# EAGLE schematic stm32 v1.1 (EAGLE 9.6.2)
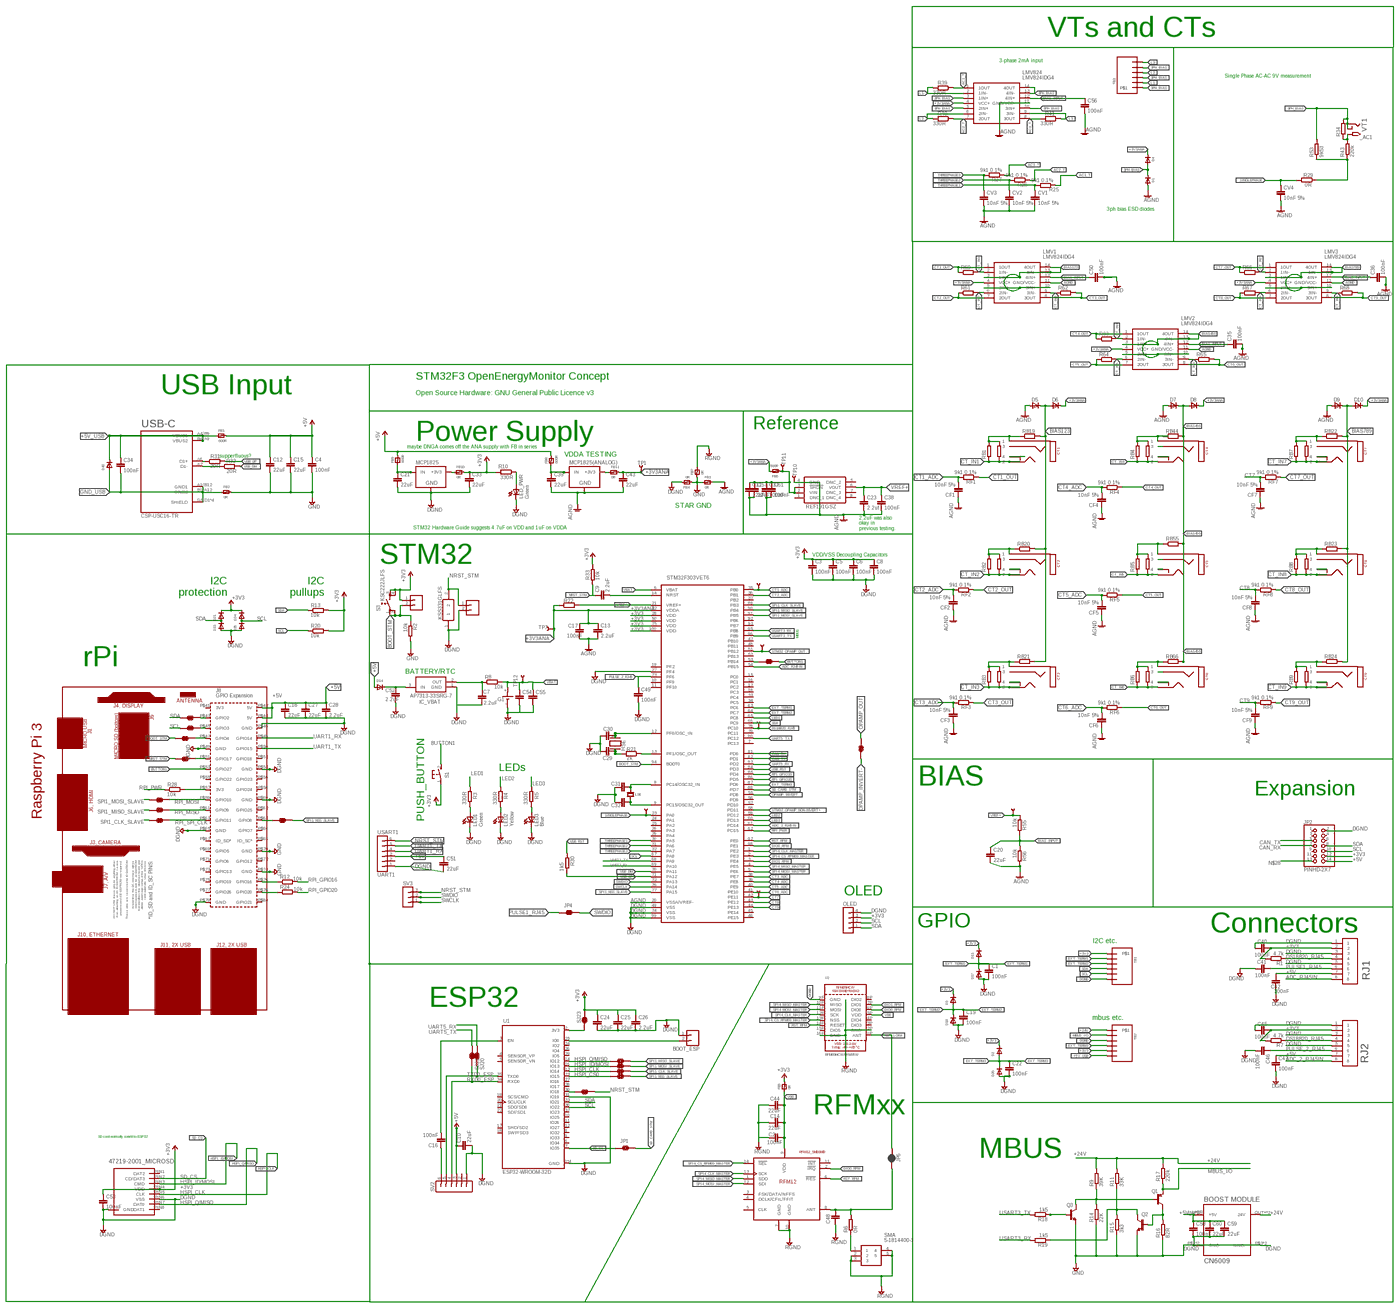
[diagram p0: schematic, sheet 1, overview]
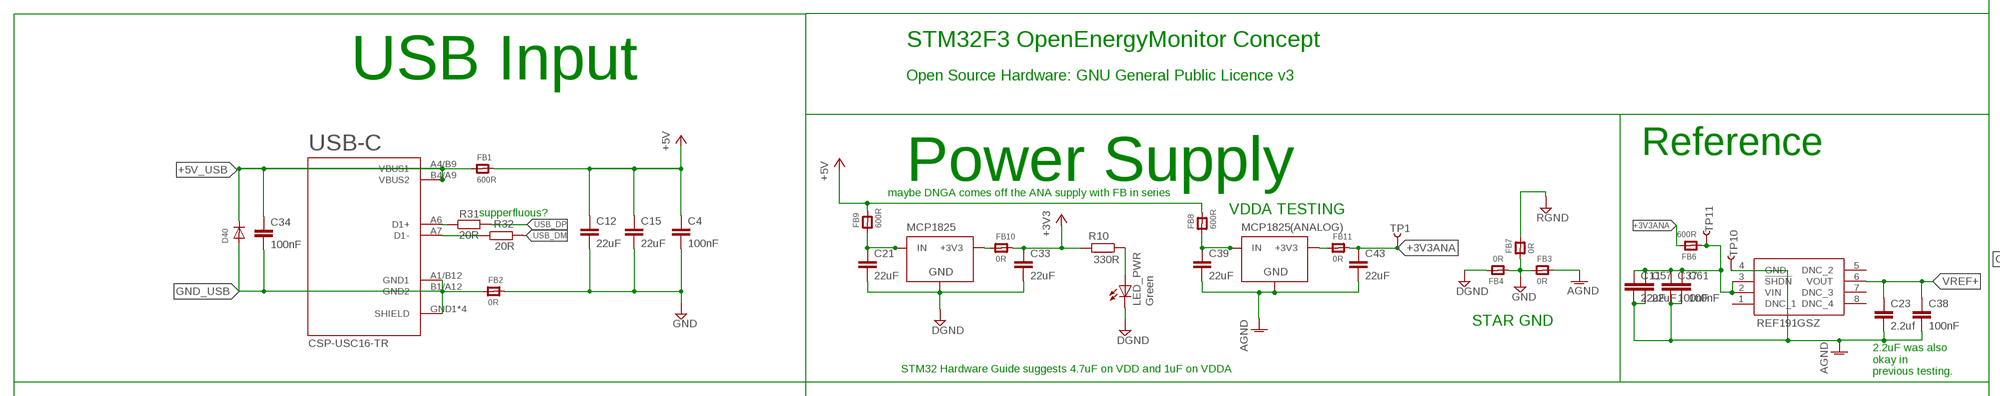
[diagram p1: schematic, sheet 1, part 1 of 4]
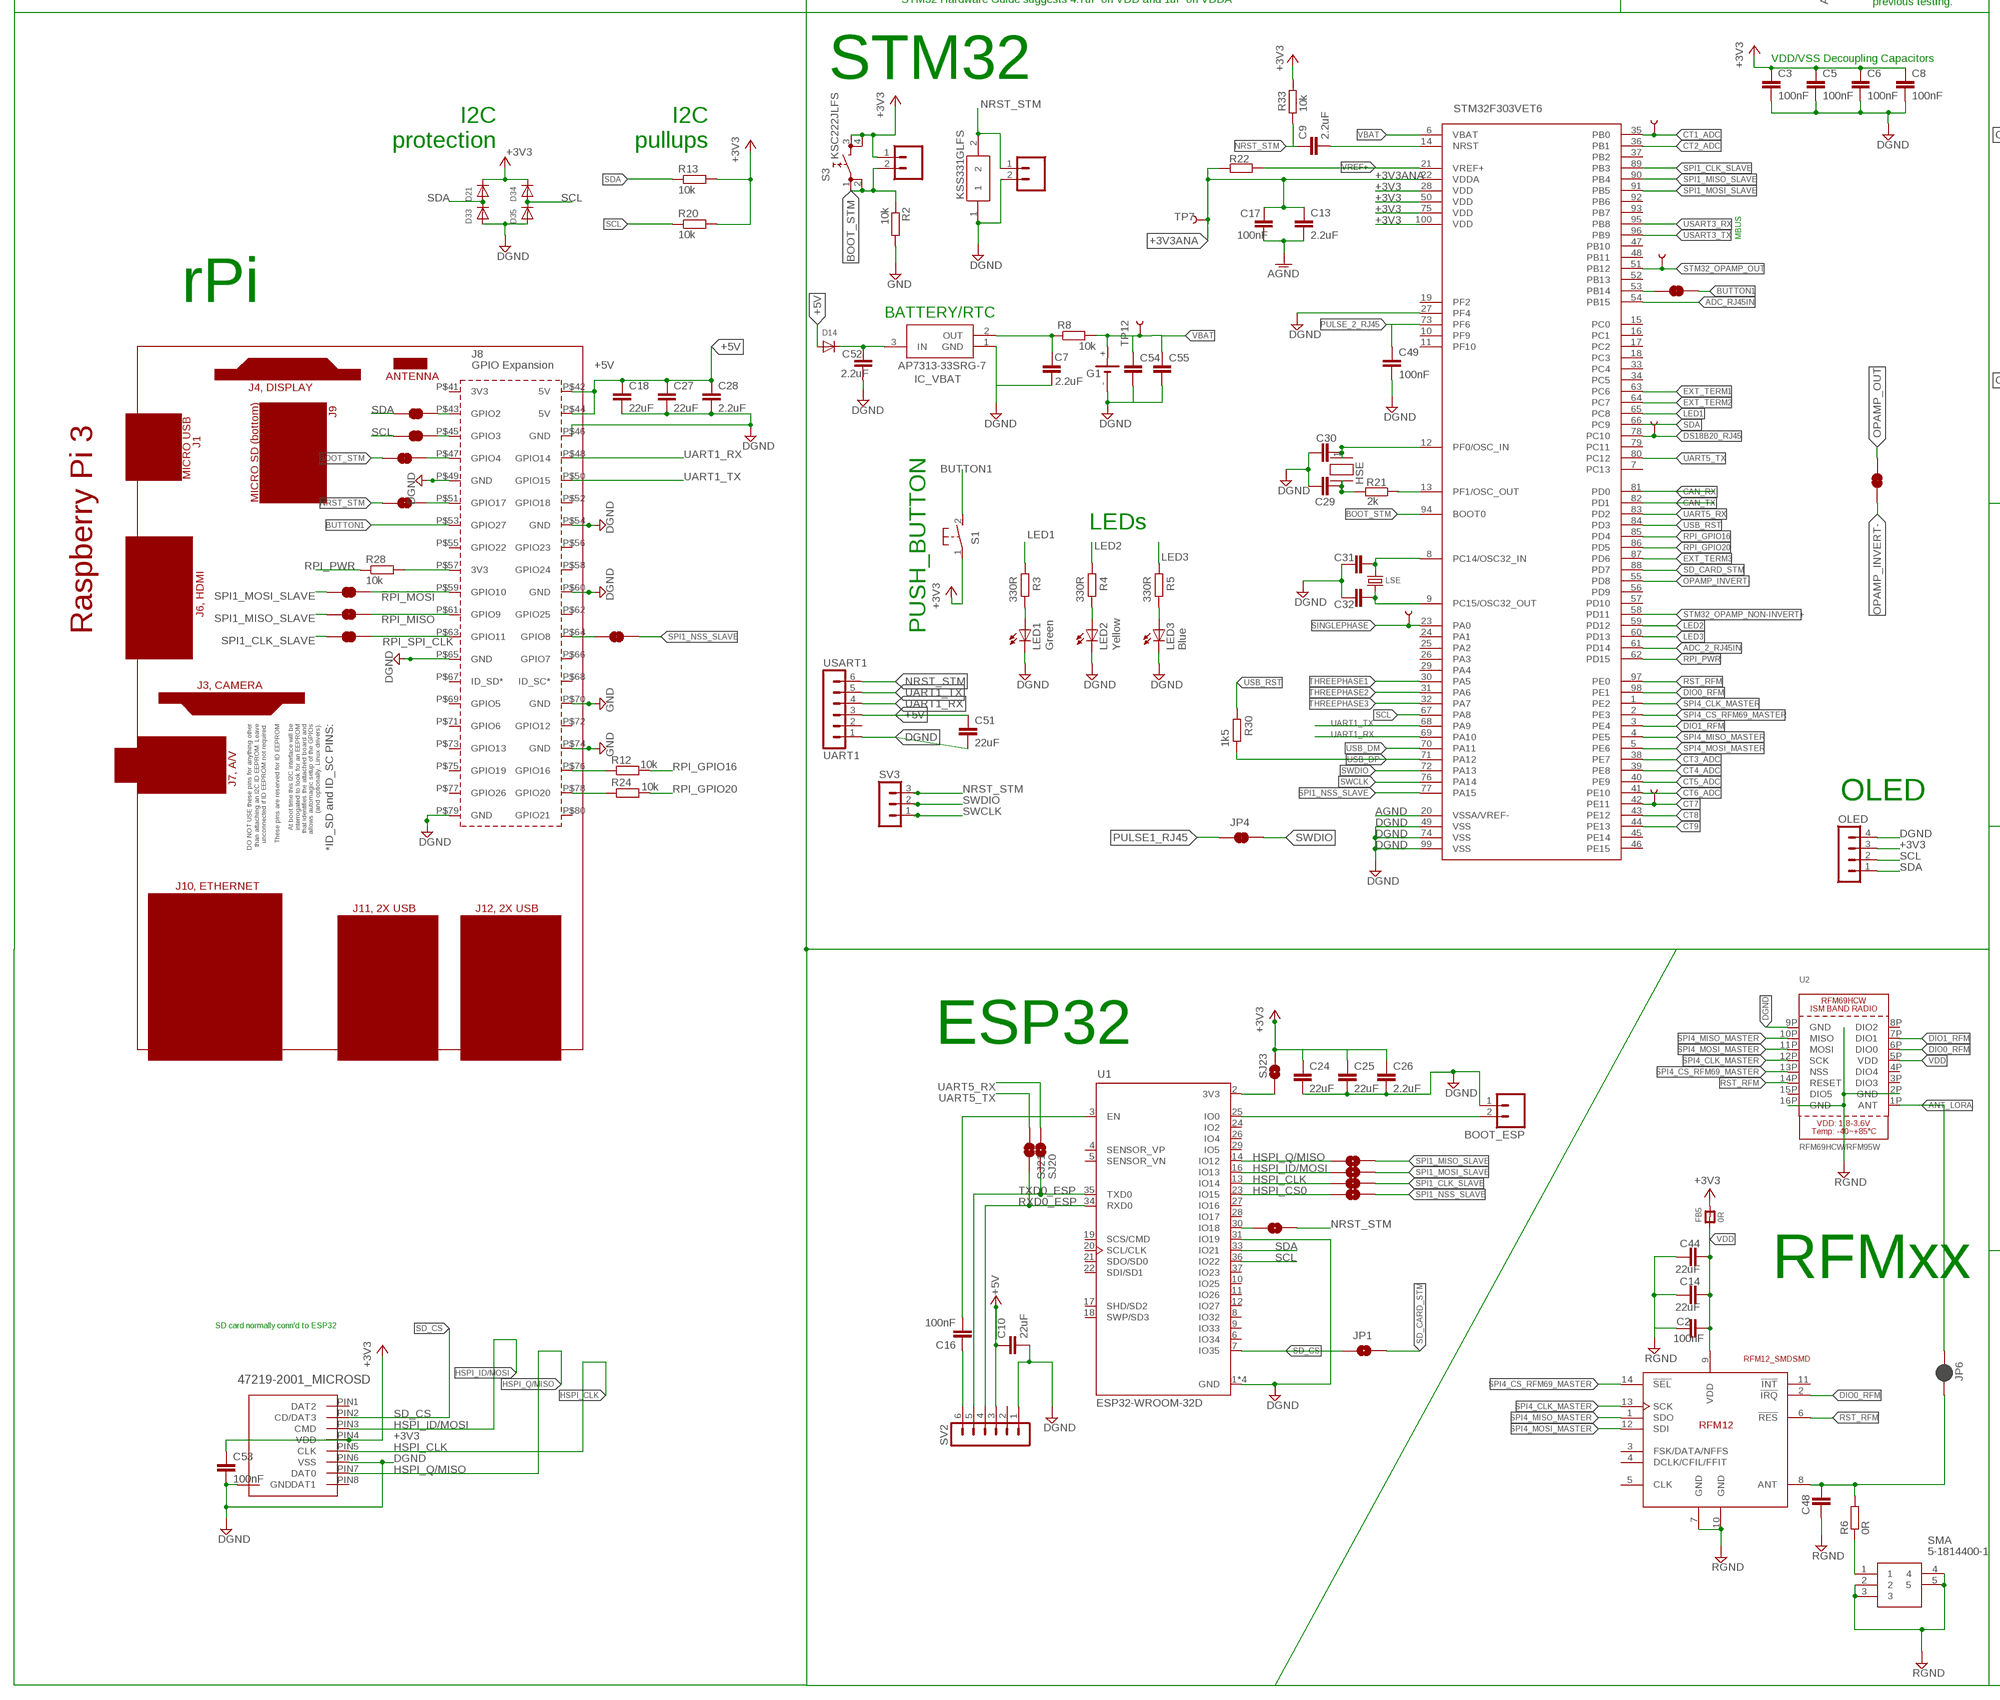
[diagram p2: schematic, sheet 1, part 2 of 4]
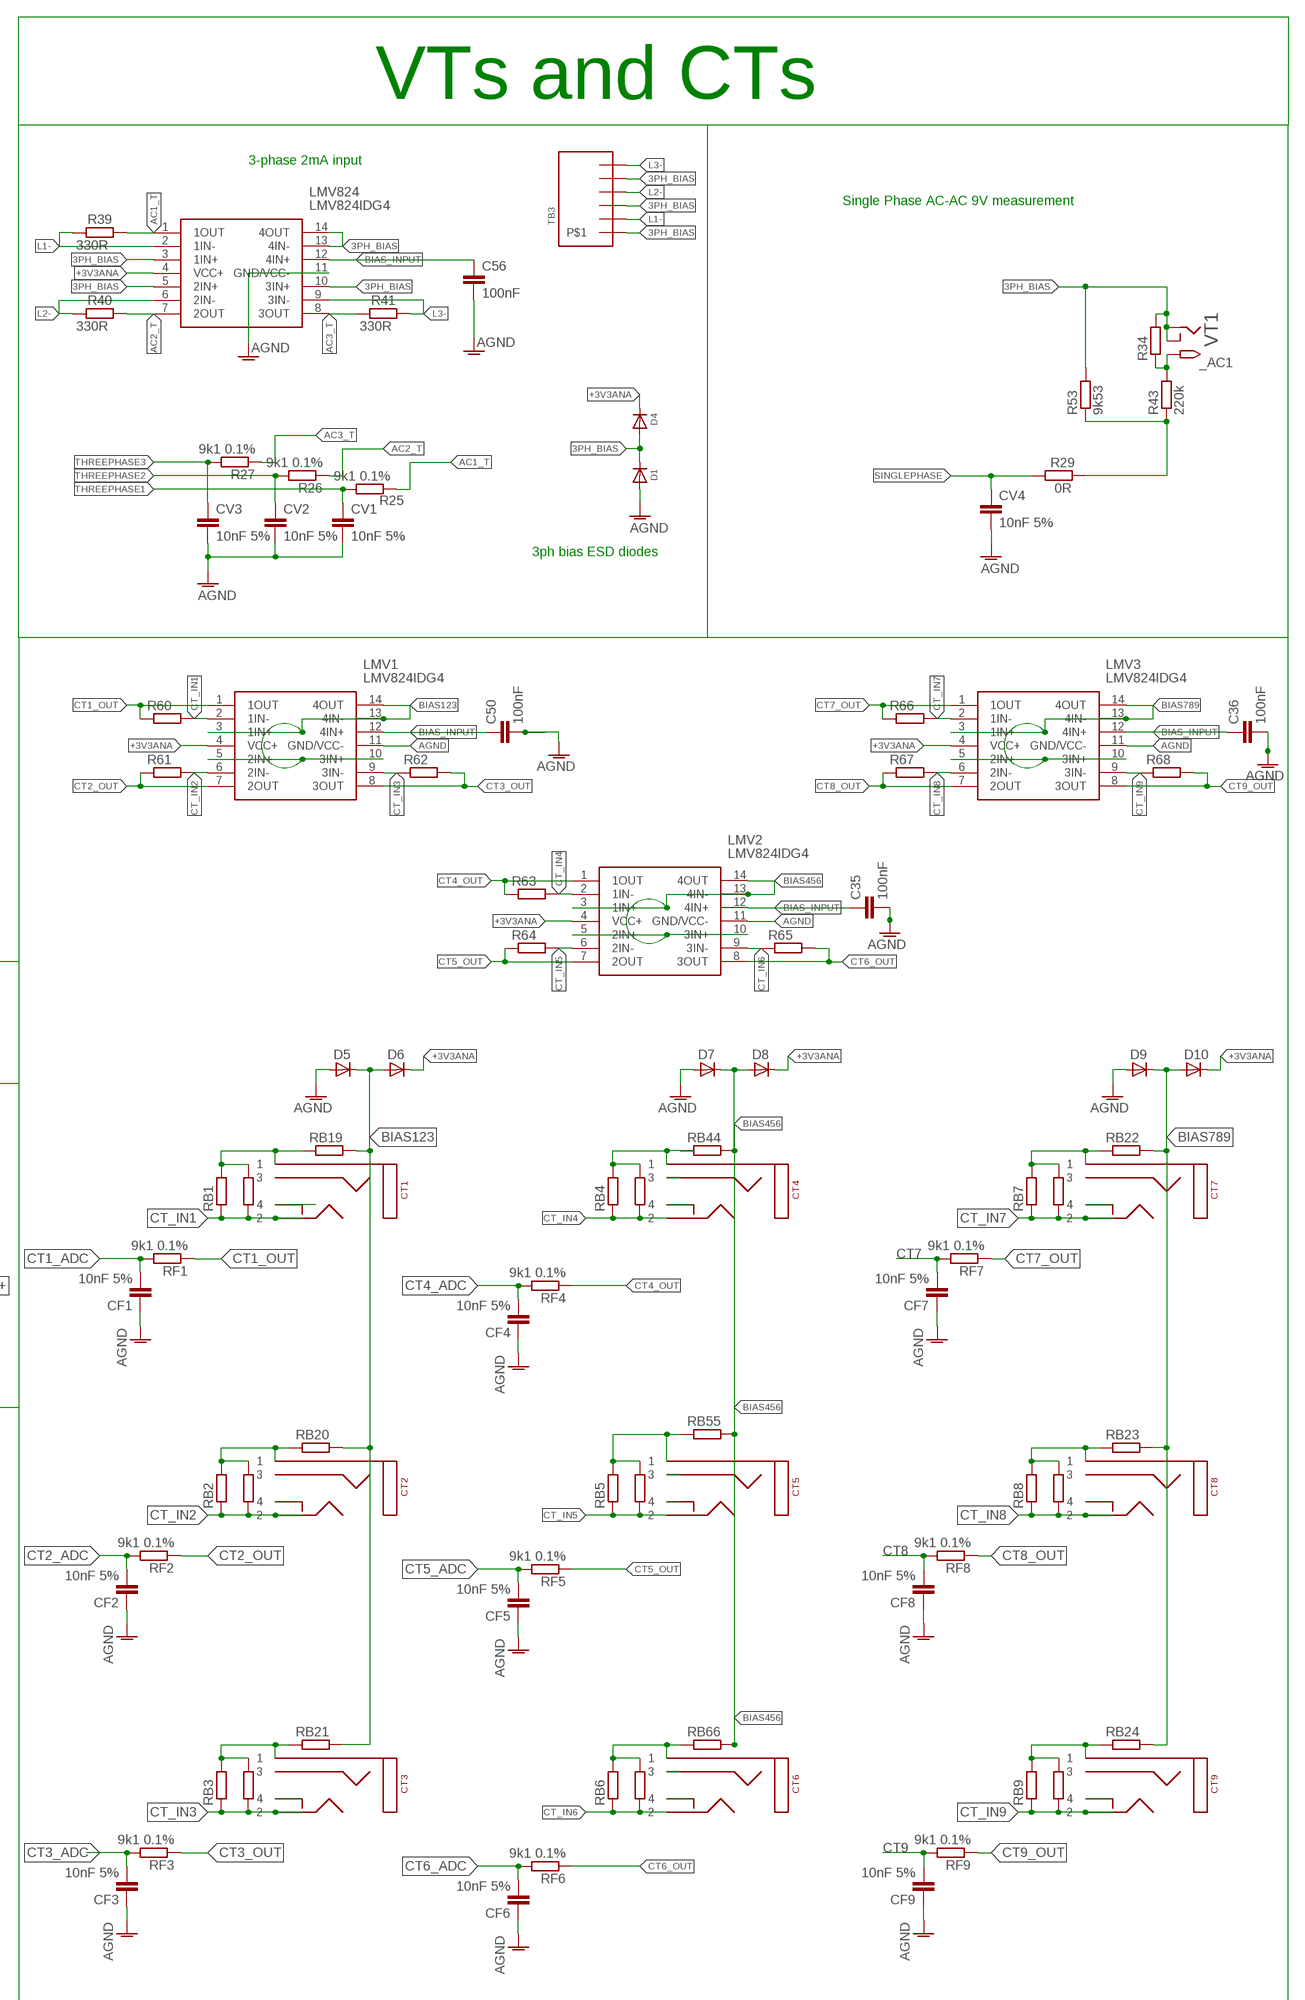
[diagram p3: schematic, sheet 1, part 3 of 4]
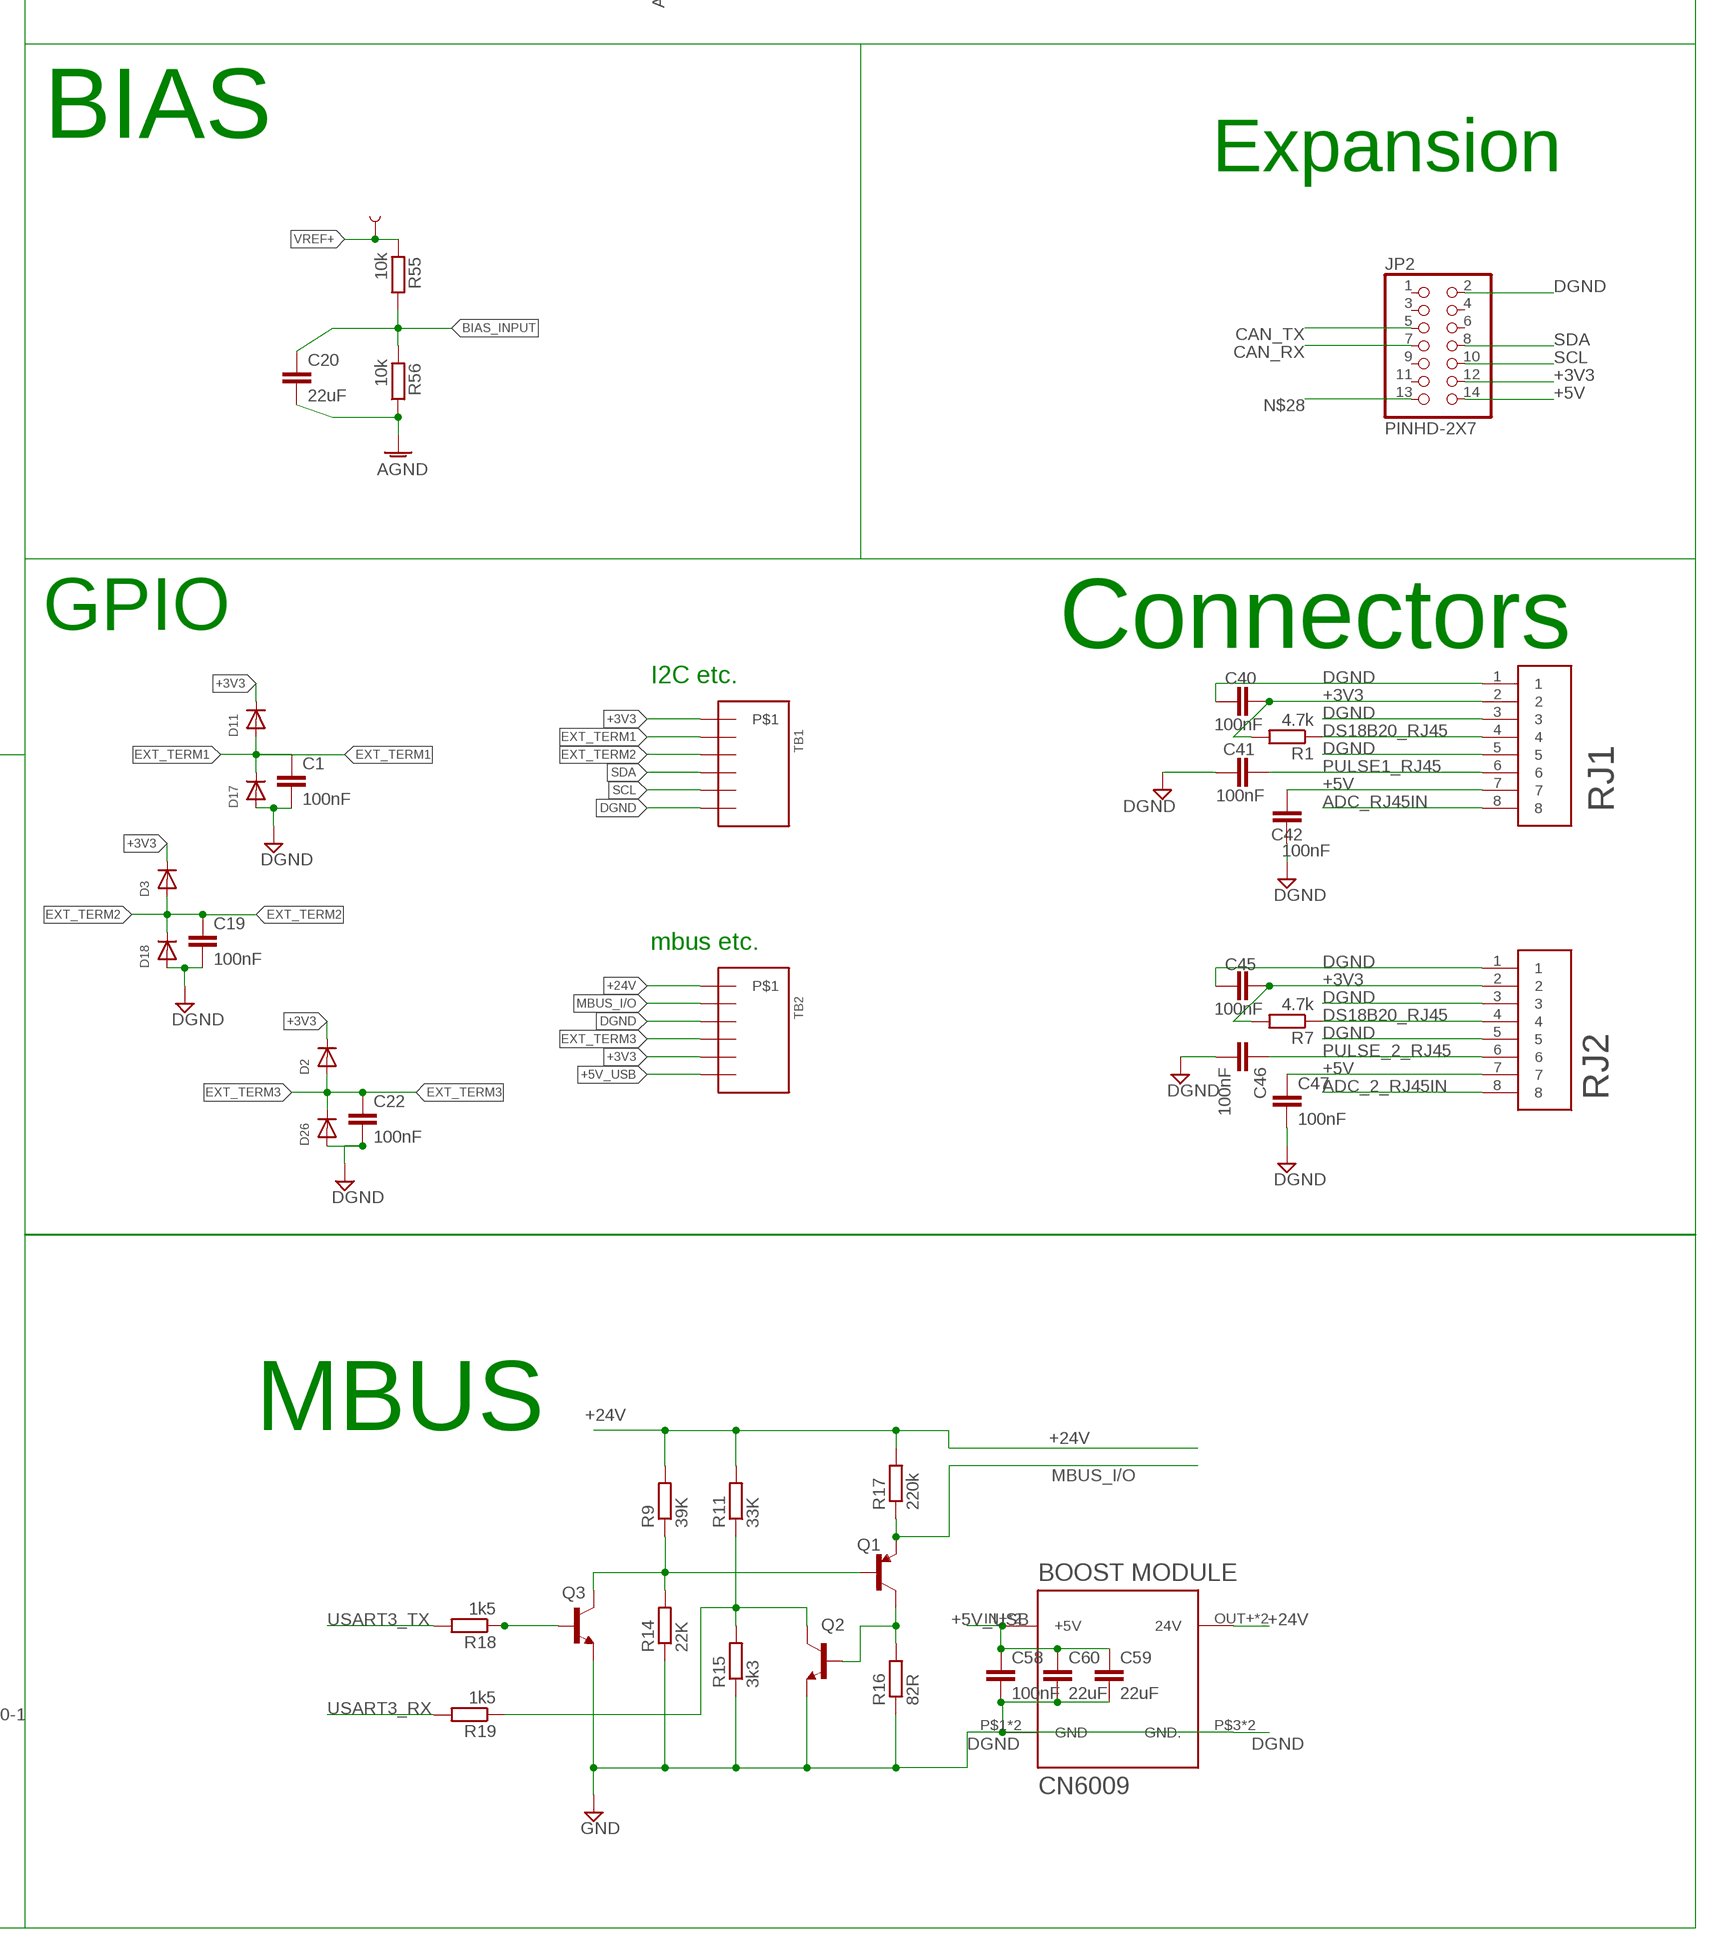
[diagram p4: schematic, sheet 1, part 4 of 4]

## Parts
BOOT  M02PTH  [1X02]
BOOT_ESP  M02PTH  [1X02]
C1  100nF  C-EUC0603  [C0603]
C2  100nF  C-EUC0603  [C0603]
C3  100nF  C-EUC0603  [C0603]
C4  100nF  C-EUC0603  [C0603]
C5  100nF  C-EUC0603  [C0603]
C6  100nF  C-EUC0603  [C0603]
C7  2.2uF  C-EUC0603  [C0603]
C8  100nF  C-EUC0603  [C0603]
C9  2.2uF  C-EUC0603  [C0603]
C10  22uF  C-EUC0805  [C0805]
C11  22uF  C-EUC0805  [C0805]
C12  22uF  C-EUC0805  [C0805]
C13  2.2uF  C-EUC0603  [C0603]
C14  22uF  C-EUC0805  [C0805]
C15  22uF  C-EUC0805  [C0805]
C16  100nF  C-EUC0603  [C0603]
C17  100nF  C-EUC0603  [C0603]
C18  22uF  C-EUC0805  [C0805]
C19  100nF  C-EUC0603  [C0603]
C20  22uF  C-EUC0805  [C0805]
C21  22uF  C-EUC0805  [C0805]
C22  100nF  C-EUC0603  [C0603]
C23  2.2uf  C-EUC0603  [C0603]
C24  22uF  C-EUC0805  [C0805]
C25  22uF  C-EUC0805  [C0805]
C26  2.2uF  C-EUC0603  [C0603]
C27  22uF  C-EUC0805  [C0805]
C28  2.2uF  C-EUC0603  [C0603]
C29  15pF  C-EUC0603  [C0603]
C30  15pF  C-EUC0603  [C0603]
C31  10pF  C-EUC0603  [C0603]
C32  10pF  C-EUC0603  [C0603]
C33  22uF  C-EUC0805  [C0805]
C34  100nF  C-EUC0603  [C0603]
C35  100nF  C-EUC0603  [C0603]
C36  100nF  C-EUC0603  [C0603]
C37  100nF  C-EUC0603  [C0603]
C38  100nF  C-EUC0603  [C0603]
C39  22uF  C-EUC0805  [C0805]
C40  100nF  C-EUC0603  [C0603]
C41  100nF  C-EUC0603  [C0603]
C42  100nF  C-EUC0603  [C0603]
C43  22uF  C-EUC0805  [C0805]
C44  22uF  C-EUC0805  [C0805]
C45  100nF  C-EUC0603  [C0603]
C46  100nF  C-EUC0603  [C0603]
C47  100nF  C-EUC0603  [C0603]
C48  C-EUC0603  [C0603]
C49  100nF  C-EUC0603  [C0603]
C50  100nF  C-EUC0603  [C0603]
C51  22uF  C-EUC0805  [C0805]
C52  2.2uF  C-EUC0603  [C0603]
C53  100nF  C-EUC0603  [C0603]
C54  22uF  C-EUC0805  [C0805]
C55  22uF  C-EUC0805  [C0805]
C56  100nF  C-EUC0603  [C0603]
C57  22uF  C-EUC0805  [C0805]
C58  100nF  C-EUC0603  [C0603]
C59  22uF  C-EUC0805  [C0805]
C60  22uF  C-EUC0805  [C0805]
C61  100nF  C-EUC0603  [C0603]
CF1  10nF 5%  C-EUC0805  [C0805]
CF2  10nF 5%  C-EUC0805  [C0805]
CF3  10nF 5%  C-EUC0805  [C0805]
CF4  10nF 5%  C-EUC0805  [C0805]
CF5  10nF 5%  C-EUC0805  [C0805]
CF6  10nF 5%  C-EUC0805  [C0805]
CF7  10nF 5%  C-EUC0805  [C0805]
CF8  10nF 5%  C-EUC0805  [C0805]
CF9  10nF 5%  C-EUC0805  [C0805]
CT1  SJ-3523-SMT  SJ-3523-SMTSJ-352X-SMT_SERIES-1313220  [SJ-352X-SMT]
CT2  SJ-3523-SMT  SJ-3523-SMTSJ-352X-SMT_SERIES-1313220  [SJ-352X-SMT]
CT3  SJ-3523-SMT  SJ-3523-SMTSJ-352X-SMT_SERIES-1313220  [SJ-352X-SMT]
CT4  SJ-3523-SMT  SJ-3523-SMTSJ-352X-SMT_SERIES-1313220  [SJ-352X-SMT]
CT5  SJ-3523-SMT  SJ-3523-SMTSJ-352X-SMT_SERIES-1313220  [SJ-352X-SMT]
CT6  SJ-3523-SMT  SJ-3523-SMTSJ-352X-SMT_SERIES-1313220  [SJ-352X-SMT]
CT7  SJ-3523-SMT  SJ-3523-SMTSJ-352X-SMT_SERIES-1313220  [SJ-352X-SMT]
CT8  SJ-3523-SMT  SJ-3523-SMTSJ-352X-SMT_SERIES-1313220  [SJ-352X-SMT]
CT9  SJ-3523-SMT  SJ-3523-SMTSJ-352X-SMT_SERIES-1313220  [SJ-352X-SMT]
CV1  10nF 5%  C-EUC0805  [C0805]
CV2  10nF 5%  C-EUC0805  [C0805]
CV3  10nF 5%  C-EUC0805  [C0805]
CV4  10nF 5%  C-EUC0805  [C0805]
D1  DIODESOD-523  [SOD-523]
D2  ESD5Z3.3T1G  DIODESOD-523  [SOD-523]
D3  ESD5Z3.3T1G  DIODESOD-523  [SOD-523]
D4  DIODESOD-523  [SOD-523]
D5  DIODESOD-523  [SOD-523]
D6  DIODESOD-523  [SOD-523]
D7  DIODESOD-523  [SOD-523]
D8  DIODESOD-523  [SOD-523]
D9  DIODESOD-523  [SOD-523]
D10  DIODESOD-523  [SOD-523]
D11  ESD5Z3.3T1G  DIODESOD-523  [SOD-523]
D14  ESD5Z3.3T1G  DIODESOD-523  [SOD-523]
D17  ESD5Z3.3T1G  DIODESOD-523  [SOD-523]
D18  ESD5Z3.3T1G  DIODESOD-523  [SOD-523]
D21  ESD5Z3.3T1G  DIODESOD-523  [SOD-523]
D26  ESD5Z3.3T1G  DIODESOD-523  [SOD-523]
D33  ESD5Z3.3T1G  DIODESOD-523  [SOD-523]
D34  ESD5Z3.3T1G  DIODESOD-523  [SOD-523]
D35  ESD5Z3.3T1G  DIODESOD-523  [SOD-523]
D40  ESD5Z5.0T1G  DIODESOD-523  [SOD-523]
FB1  600R  FERRITE  [0603]
FB2  0R  FERRITE  [0603]
FB3  0R  FERRITE_0603  [_0603]
FB4  0R  FERRITE_0603  [_0603]
FB5  0R  FERRITE_0603  [_0603]
FB6  600R  FERRITE_0603  [_0603]
FB7  0R  FERRITE_0603  [_0603]
FB8  600R  FERRITE_0603  [_0603]
FB9  600R  FERRITE_0603  [_0603]
FB10  0R  FERRITE_0603  [_0603]
FB11  0R  FERRITE_0603  [_0603]
G1  CH291-1220LF  [CH291-1220LF]
HSE  6MM_3.5MM_CRYSTAL  [ABMM2]
IC_VBAT  AP7313-33SRG-7  [SOT96P240X135-3N]
J1  JUMPER-SMT_2_NC_TRACE_NO-SILK  [SMT-JUMPER_2_NC_TRACE_NO-SILK]
JP1  JUMPER-SMT_2_NO_NO-SILK  [SMT-JUMPER_2_NO_NO-SILK]
JP2  PINHD-2X7  [2X07]
JP4  JUMPER-SMT_2_NC_TRACE_NO-SILK  [SMT-JUMPER_2_NC_TRACE_NO-SILK]
JP6  JUMPER-SMT_2_NC_PASTE_SILK  [SMT-JUMPER_2_NC_PASTE_SILK]
KSS331GLFS  KSS221GLFS  [KSS]
LED1  Green  LEDCHIP-LED0805  [CHIP-LED0805]
LED2  Yellow  LEDCHIP-LED0805  [CHIP-LED0805]
LED3  Blue  LEDCHIP-LED0805  [CHIP-LED0805]
LED_PWR  Green  LEDCHIP-LED0805  [CHIP-LED0805]
LMV1  LMV824IDG4  [SOIC127P600X175-14N]
LMV2  LMV824IDG4  [SOIC127P600X175-14N]
LMV3  LMV824IDG4  [SOIC127P600X175-14N]
LMV824  LMV824IDG4  [SOIC127P600X175-14N]
LSE  32.768kHz  CRYSTAL8X3.8SMT  [CRYSTAL_8X3.8]
MCP1825  MCP1825SOT-223-3  [SOT-223]
MCP1825(ANALOG)  MCP1825SOT-223-3  [SOT-223]
MICROSD  47219-2001_MICROSD  [47219-2001_MICROSD]
OLED  MA04-1-OLEDOLED  [MA04-1-OLED]
PCB2  RPI3YA  [RPI3MIRROR2]
Q1  PNP  TRANSISTOR_PNPSOT23-REFLOW  [SOT23-R]
Q2  NPN  TRANSISTOR_NPN  [SOT23-R]
Q3  NPN  TRANSISTOR_NPN  [SOT23-R]
R1  4.7k  R-EU_R0603  [R0603]
R2  10k  R-EU_R0603  [R0603]
R3  330R  R-EU_R0603  [R0603]
R4  330R  R-EU_R0603  [R0603]
R5  330R  R-EU_R0603  [R0603]
R6  0R  R-EU_R0603  [R0603]
R7  4.7k  R-EU_R0603  [R0603]
R8  10k  R-EU_R0603  [R0603]
R9  39K  R-EU_R0603  [R0603]
R10  330R  R-EU_R0603  [R0603]
R11  33K  R-EU_R0603  [R0603]
R12  10k  R-EU_R0603  [R0603]
R13  10k  R-EU_R0603  [R0603]
R14  22K  R-EU_R0603  [R0603]
R15  3k3  R-EU_R0603  [R0603]
R16  82R  R-EU_R0603  [R0603]
R17  220k  R-EU_R0603  [R0603]
R18  1k5  R-EU_R0603  [R0603]
R19  1k5  R-EU_R0603  [R0603]
R20  10k  R-EU_R0603  [R0603]
R21  2k  R-EU_R0603  [R0603]
R22  R-EU_R0603  [R0603]
R24  10k  R-EU_R0603  [R0603]
R25  9k1 0.1%  R-EU_R0603  [R0603]
R26  9k1 0.1%  R-EU_R0603  [R0603]
R27  9k1 0.1%  R-EU_R0603  [R0603]
R28  10k  R-EU_R0603  [R0603]
R29  0R  R-EU_R0603  [R0603]
R30  1k5  R-EU_R0603  [R0603]
R31  20R  R-EU_R0603  [R0603]
R32  20R  R-EU_R0603  [R0603]
R33  10k  R-EU_R0603  [R0603]
R34  R-EU_R1210  [R1210]
R39  330R  R-EU_R0603  [R0603]
R40  330R  R-EU_R0603  [R0603]
R41  330R  R-EU_R0603  [R0603]
R43  220k  R-EU_R0603  [R0603]
R53  9k53  R-EU_R0603  [R0603]
R55  10k  R-EU_R0603  [R0603]
R56  10k  R-EU_R0603  [R0603]
R60  510R 0.1%  R-EU_R0603  [R0603]
R61  510R 0.1%  R-EU_R0603  [R0603]
R62  510R 0.1%  R-EU_R0603  [R0603]
R63  510R 0.1%  R-EU_R0603  [R0603]
R64  510R 0.1%  R-EU_R0603  [R0603]
R65  510R 0.1%  R-EU_R0603  [R0603]
R66  510R 0.1%  R-EU_R0603  [R0603]
R67  510R 0.1%  R-EU_R0603  [R0603]
R68  510R 0.1%  R-EU_R0603  [R0603]
RB1  6R81  R-EU_R0805  [R0805]
RB1_  R-EU_0207/10  [0207/10]
RB2  6R81  R-EU_R0805  [R0805]
RB2_  R-EU_0207/10  [0207/10]
RB3  6R81  R-EU_R0805  [R0805]
RB3_  R-EU_0207/10  [0207/10]
RB4  6R81  R-EU_R0805  [R0805]
RB4_  R-EU_0207/10  [0207/10]
RB5  6R81  R-EU_R0805  [R0805]
RB5_  R-EU_0207/10  [0207/10]
RB6  6R81  R-EU_R0805  [R0805]
RB6_  R-EU_0207/10  [0207/10]
RB7  6R81  R-EU_R0805  [R0805]
RB7_  R-EU_0207/10  [0207/10]
RB8  6R81  R-EU_R0805  [R0805]
RB8_  R-EU_0207/10  [0207/10]
RB9  6R81  R-EU_R0805  [R0805]
RB9_  R-EU_0207/10  [0207/10]
RB19  680R | 681R 0.1%  R-EU_R0603  [R0603]
RB20  680R | 681R 0.1%  R-EU_R0603  [R0603]
RB21  680R | 681R 0.1%  R-EU_R0603  [R0603]
RB22  680R | 681R 0.1%  R-EU_R0603  [R0603]
RB23  680R | 681R 0.1%  R-EU_R0603  [R0603]
RB24  680R | 681R 0.1%  R-EU_R0603  [R0603]
RB44  680R | 681R 0.1%  R-EU_R0603  [R0603]
RB55  680R | 681R 0.1%  R-EU_R0603  [R0603]
RB66  680R | 681R 0.1%  R-EU_R0603  [R0603]
REF19X  REF191ESZ  LT1461AIS8-3.3#PBF  [SOIC127P599X175-8N]
RF1  9k1 0.1%  R-EU_R0603  [R0603]
RF2  9k1 0.1%  R-EU_R0603  [R0603]
RF3  9k1 0.1%  R-EU_R0603  [R0603]
RF4  9k1 0.1%  R-EU_R0603  [R0603]
RF5  9k1 0.1%  R-EU_R0603  [R0603]
RF6  9k1 0.1%  R-EU_R0603  [R0603]
RF7  9k1 0.1%  R-EU_R0603  [R0603]
RF8  9k1 0.1%  R-EU_R0603  [R0603]
RF9  9k1 0.1%  R-EU_R0603  [R0603]
RFM69HCW  RFM12_SMDSMD  [RFM12]
RJ1  95501-6889  [955016889]
RJ2  95501-6889  [955016889]
RST_STM  M02PTH  [1X02]
S1  31-XX  [B3F-31XX]
S3  KSC222JLFS  [KSC222JLFS]
SJ1  JUMPER-SMT_2_NC_TRACE_NO-SILK  [SMT-JUMPER_2_NC_TRACE_NO-SILK]
SJ3  JUMPER-SMT_2_NC_TRACE_NO-SILK  [SMT-JUMPER_2_NC_TRACE_NO-SILK]
SJ4  JUMPER-SMT_2_NO_SILK  [SMT-JUMPER_2_NO_SILK]
SJ5  JUMPER-SMT_2_NC_TRACE_NO-SILK  [SMT-JUMPER_2_NC_TRACE_NO-SILK]
SJ6  JUMPER-SMT_2_NC_TRACE_NO-SILK  [SMT-JUMPER_2_NC_TRACE_NO-SILK]
SJ7  JUMPER-SMT_2_NC_TRACE_NO-SILK  [SMT-JUMPER_2_NC_TRACE_NO-SILK]
SJ9  JUMPER-SMT_2_NO_SILK  [SMT-JUMPER_2_NO_SILK]
SJ10  JUMPER-SMT_2_NO_SILK  [SMT-JUMPER_2_NO_SILK]
SJ13  JUMPER-SMT_2_NO_SILK  [SMT-JUMPER_2_NO_SILK]
SJ14  JUMPER-SMT_2_NC_TRACE_NO-SILK  [SMT-JUMPER_2_NC_TRACE_NO-SILK]
SJ20  SOLDERJUMPERNO  [SJ_2S-NO]
SJ21  SOLDERJUMPERNO  [SJ_2S-NO]
SJ23  SOLDERJUMPERNO  [SJ_2S-NO]
SJ25  SOLDERJUMPERNO  [SJ_2S-NO]
SJ26  JUMPER-SMT_2_NC_TRACE_NO-SILK  [SMT-JUMPER_2_NC_TRACE_NO-SILK]
SJ27  JUMPER-SMT_2_NC_TRACE_NO-SILK  [SMT-JUMPER_2_NC_TRACE_NO-SILK]
SJ32  JUMPER-SMT_2_NC_TRACE_NO-SILK  [SMT-JUMPER_2_NC_TRACE_NO-SILK]
SMA  5-1814400-1  [518144001]
STM32F303VET6  STM32F303VE  STM32F303XB  [TQFP100]
SV2  MA06-1  [MA06-1]
SV3  MA03-1  [MA03-1]
TB1  3.5MM_TB_X6  [3.5MM_X6]
TB2  3.5MM_TB_X6  [3.5MM_X6]
TB3  3.5MM_TB_X6  [3.5MM_X6]
TP1  TEST-POINTPOGO_PTH  [1X01_NO_SILK]
TP2  TEST-POINTPOGO_PTH  [1X01_NO_SILK]
TP7  TEST-POINTPOGO_PTH  [1X01_NO_SILK]
TP8  TEST-POINTPOGO_PTH  [1X01_NO_SILK]
TP9  TEST-POINTPOGO_PTH  [1X01_NO_SILK]
TP10  TEST-POINTPOGO_PTH  [1X01_NO_SILK]
TP11  TEST-POINTPOGO_PTH  [1X01_NO_SILK]
TP12  TEST-POINT3  [PAD.03X.03]
TP18  TEST-POINTPOGO_PTH  [1X01_NO_SILK]
TP19  TEST-POINTPOGO_PTH  [1X01_NO_SILK]
TP20  TEST-POINTPOGO_PTH  [1X01_NO_SILK]
U1  ESP32-WROOM-32D  [MODULE_ESP32-WROOM-32D]
U2  RFM69HCW/RFM95W  RFM69HCW_SMT  [RFMHCW_SMT]
U$2  BOOST_MODULEBOTHCONN  [BOOST]
USART1  UART1  MA06-1  [MA06-1]
USB-C  CSP-USC16-TR  [USB-C]
VT1  ADC-028-2-T  2.1MMJACKSMT  [DCJACK_2MM_SMT]

## Nets
3PH_BIAS: D1.K(C) D4.A LMV824.3(1IN+) LMV824.5(2IN+) LMV824.10(3IN+) LMV824.13(4IN-) LMV824.14(4OUT) R34.2 R53.2 TB3.P$1 TB3.P$3 TB3.P$5 VT1.GND(RING) VT1.GNDBREAK(RING_SW)
+3V3 [power]: BOOT.1 C3.1 C5.1 C6.1 C8.1 C24.1 C25.1 C26.1 C33.1 C40.1 C45.1 C53.1 D2.K(C) D3.K(C) D11.K(C) D21.K(C) D34.K(C) FB5.2 FB10.2 JP2.12 MICROSD.PIN4(VDD) OLED.3 R1.2 R7.2 R10.2 R13.2 R20.2 R33.1 RJ1.2 RJ2.2 S1.1(P) S3.3 S3.4 SJ23.2 STM32F303VET6.28(VDD) STM32F303VET6.50(VDD) STM32F303VET6.75(VDD) STM32F303VET6.100(VDD) TB1.P$1 TB2.P$5
+3V3ANA [power]: C13.1 C17.1 C43.1 D4.K(C) D6.K(C) D8.K(C) D10.K(C) FB6.2 FB11.2 LMV1.4(VCC+) LMV2.4(VCC+) LMV3.4(VCC+) LMV824.4(VCC+) R22.1 STM32F303VET6.22(VDDA) TP1.1 TP7.1
+5V [power]: C4.1 C10.1 C12.1 C15.1 C18.1 C27.1 C28.1 C42.1 C47.1 C51.1 D14.A FB1.2 FB8.2 FB9.2 JP2.14 PCB2.P$42(5V) PCB2.P$44(5V) RJ1.7 RJ2.7 SV2.3 USART1.3
+5V_A [power]: C39.1 FB8.1 MCP1825(ANALOG).1(IN)
+5V_BATT [power]: C52.1 D14.K(C) IC_VBAT.3(IN)
+5V_D [power]: C21.1 FB9.1 MCP1825.1(IN)
+5V_USB [power]: C34.1 C58.1 C59.1 C60.1 D40.K(C) FB1.1 TB2.P$6 U$2.IN+1(+5V) U$2.IN+(+5V) USB-C.A4/B9(VBUS1) USB-C.B4/A9(VBUS2)
+24V: R9.2 R11.2 R17.2 TB2.P$1 U$2.OUT+1(24V) U$2.OUT+(24V)
_AC1: R34.1 R43.2 VT1.PWR2(TIP)
AC1: R29.1 R43.1 R53.1
AC1_T: LMV824.1(1OUT) R25.1 R39.1
AC2_T: LMV824.7(2OUT) R26.1 R40.1
AC3_T: LMV824.8(3OUT) R27.1 R41.2
ADC_2_RJ45IN: RJ2.8 STM32F303VET6.61(PD14)
ADC_RJ45IN: RJ1.8 STM32F303VET6.54(PB15)
AGND [gnd]: C11.2 C13.2 C17.2 C20.2 C23.2 C35.2 C36.2 C37.2 C38.2 C39.2 C43.2 C50.2 C56.2 C57.2 C61.2 CF1.1 CF2.1 CF3.1 CF4.1 CF5.1 CF6.1 CF7.1 CF8.1 CF9.1 CV1.2 CV2.2 CV3.2 CV4.2 D1.A D5.A D7.A D9.A FB3.2 LMV1.11(GND/VCC-) LMV2.11(GND/VCC-) LMV3.11(GND/VCC-) LMV824.11(GND/VCC-) MCP1825(ANALOG).2(GND) MCP1825(ANALOG).4(GND) R56.1 REF19X.4(GND) STM32F303VET6.20(VSSA/VREF-) TP10.1
ANT [ant]: C48.1 JP6.2 R6.2 RFM69HCW.8(ANT)
ANT_LORA [ant]: JP6.1 U2.1P(ANT)
BIAS123: D5.K(C) D6.A LMV1.3(1IN+) LMV1.5(2IN+) LMV1.10(3IN+) LMV1.13(4IN-) LMV1.14(4OUT) RB19.2 RB20.2 RB21.2
BIAS456: D7.K(C) D8.A LMV2.3(1IN+) LMV2.5(2IN+) LMV2.10(3IN+) LMV2.13(4IN-) LMV2.14(4OUT) RB44.2 RB55.2 RB66.2
BIAS789: D9.K(C) D10.A LMV3.3(1IN+) LMV3.5(2IN+) LMV3.10(3IN+) LMV3.13(4IN-) LMV3.14(4OUT) RB22.2 RB23.2 RB24.2
BIAS_INPUT: C20.1 C35.1 C36.1 C50.1 C56.1 LMV1.12(4IN+) LMV2.12(4IN+) LMV3.12(4IN+) LMV824.12(4IN+) R55.1 R56.2
BOOT0_RPI: J1.2 PCB2.P$47(GPIO4)
BOOT_STM: BOOT.2 J1.1 R2.1 S3.1 S3.2 STM32F303VET6.94(BOOT0)
BUTTON1: PCB2.P$53(GPIO27) S1.2(S) SJ3.1
BUTTON1_STM: SJ3.2 STM32F303VET6.53(PB14)
CAN_RX: JP2.7 STM32F303VET6.81(PD0)
CAN_TX: JP2.5 STM32F303VET6.82(PD1)
CT1_ADC [cts_vts]: CF1.2 RF1.2 STM32F303VET6.35(PB0) TP18.1
CT1_OUT: LMV1.1(1OUT) R60.1 RF1.1
CT2_ADC [cts_vts]: CF2.2 RF2.2 STM32F303VET6.36(PB1)
CT2_OUT: LMV1.7(2OUT) R61.1 RF2.1
CT3_ADC [cts_vts]: CF3.2 RF3.2 STM32F303VET6.38(PE7)
CT3_OUT: LMV1.8(3OUT) R62.2 RF3.1
CT4_ADC [cts_vts]: CF4.2 RF4.2 STM32F303VET6.39(PE8)
CT4_OUT: LMV2.1(1OUT) R63.1 RF4.1
CT5_ADC [cts_vts]: CF5.2 RF5.2 STM32F303VET6.40(PE9)
CT5_OUT: LMV2.7(2OUT) R64.1 RF5.1
CT6_ADC [cts_vts]: CF6.2 RF6.2 STM32F303VET6.41(PE10)
CT6_OUT: LMV2.8(3OUT) R65.2 RF6.1
CT7 [cts_vts]: CF7.2 RF7.2 STM32F303VET6.42(PE11) TP19.1
CT7_OUT: LMV3.1(1OUT) R66.1 RF7.1
CT8 [cts_vts]: CF8.2 RF8.2 STM32F303VET6.43(PE12)
CT8_OUT: LMV3.7(2OUT) R67.1 RF8.1
CT9 [cts_vts]: CF9.2 RF9.2 STM32F303VET6.44(PE13)
CT9_OUT: LMV3.8(3OUT) R68.2 RF9.1
CT_IN1: CT1.P$2 LMV1.2(1IN-) R60.2 RB1.1 RB1_.1
CT_IN2: CT2.P$2 LMV1.6(2IN-) R61.2 RB2.1 RB2_.1
CT_IN3: CT3.P$2 LMV1.9(3IN-) R62.1 RB3.1 RB3_.1
CT_IN4: CT4.P$2 LMV2.2(1IN-) R63.2 RB4.1 RB4_.1
CT_IN5: CT5.P$2 LMV2.6(2IN-) R64.2 RB5.1 RB5_.1
CT_IN6: CT6.P$2 LMV2.9(3IN-) R65.1 RB6.1 RB6_.1
CT_IN7: CT7.P$2 LMV3.2(1IN-) R66.2 RB7.1 RB7_.1
CT_IN8: CT8.P$2 LMV3.6(2IN-) R67.2 RB8.1 RB8_.1
CT_IN9: CT9.P$2 LMV3.9(3IN-) R68.1 RB9.1 RB9_.1
DGND [gnd]: BOOT_ESP.1 C1.2 C3.2 C5.2 C6.2 C7.2 C8.2 C10.2 C18.2 C19.2 C21.2 C22.2 C24.2 C25.2 C26.2 C27.2 C28.2 C29.2 C30.2 C31.2 C32.2 C33.2 C40.2 C41.2 C42.2 C45.2 C46.2 C47.2 C49.2 C51.2 C52.2 C53.2 C54.2 C55.2 C58.2 C59.2 C60.2 D17.A D18.A D26.A D33.A D35.A FB4.2 G1.- IC_VBAT.1(GND) JP2.2 KSS331GLFS.1 LED1.C LED2.C LED3.C LED_PWR.C MCP1825.2(GND) MCP1825.4(GND) MICROSD.P$1(GND) MICROSD.P$2(GND) MICROSD.P$3(GND) MICROSD.P$4(GND) MICROSD.PIN6(VSS) OLED.4 PCB2.P$46(GND) PCB2.P$49(GND) PCB2.P$54(GND) PCB2.P$60(GND) PCB2.P$65(GND) PCB2.P$70(GND) PCB2.P$74(GND) PCB2.P$79(GND) Q2.2(E) Q3.2(E) R2.2 R14.1 R15.1 R16.1 RJ1.1 RJ1.3 RJ1.5 RJ2.1 RJ2.3 RJ2.5 RST_STM.2 STM32F303VET6.27(PF4) STM32F303VET6.49(VSS) STM32F303VET6.74(VSS) STM32F303VET6.99(VSS) SV2.1 TB1.P$6 TB2.P$3 U1.1(GND) U1.15(GND) U1.31(IO19) U1.38(GND) U1.39(GND) U2.9P(GND) U$2.P$1(GND) U$2.P$2(GND) U$2.P$3(GND.) U$2.P$4(GND.) USART1.1 ; supply symbol labelled GND
DIO0_RFM: RFM69HCW.2(!IRQ) STM32F303VET6.98(PE1) U2.6P(DIO0)
DIO1_RFM: STM32F303VET6.3(PE4) U2.7P(DIO1)
DS18B20_RJ45: R1.1 R7.1 RJ1.4 RJ2.4 STM32F303VET6.78(PC10) TP9.1
ESP_PWR_PRE: SJ23.1 U1.2(3V3)
EXT_TERM1: C1.1 D11.A D17.K(C) STM32F303VET6.63(PC6) TB1.P$2
EXT_TERM2: C19.1 D3.A D18.K(C) STM32F303VET6.64(PC7) TB1.P$3
EXT_TERM3: C22.1 D2.A D26.K(C) STM32F303VET6.87(PD6) TB2.P$4
GND [gnd]: C4.2 C12.2 C15.2 FB2.2 FB3.1 FB4.1 FB7.1
GND_USB [gnd]: C34.2 D40.A FB2.1 USB-C.A1/B12(GND1) USB-C.B1/A12(GND2) USB-C.GND1(SHIELD) USB-C.GND2(SHIELD) USB-C.GND3(SHIELD) USB-C.GND4(SHIELD)
HSE_IN: C30.1 HSE.1(CRYSTAL_1) STM32F303VET6.12(PF0/OSC_IN)
HSE_OUT: R21.1 STM32F303VET6.13(PF1/OSC_OUT)
HSE_OUT_: C29.1 HSE.3(CRYSTAL_2) R21.2
HSPI_CLK: MICROSD.PIN5(CLK) SJ10.1 U1.13(IO14)
HSPI_CS0: SJ13.1 U1.23(IO15)
HSPI_ID/MOSI: MICROSD.PIN3(CMD) SJ9.1 U1.16(IO13)
HSPI_Q/MISO: MICROSD.PIN7(DAT0) SJ4.1 U1.14(IO12)
L1-: LMV824.2(1IN-) R39.2 TB3.P$2
L2-: LMV824.6(2IN-) R40.2 TB3.P$4
L3-: LMV824.9(3IN-) R41.1 TB3.P$6
LED1: R3.2 STM32F303VET6.65(PC8)
LED2: R4.2 STM32F303VET6.59(PD12)
LED3: R5.2 STM32F303VET6.60(PD13)
MBUS_I/O: Q1.2(E) R17.1 TB2.P$2
N$1: CT1.P$4
N$2: CT4.P$4
N$5: LED2.A R4.1
N$6: LED3.A R5.1
N$7 [cts_vts]: CT5.P$1 RB5.2 RB5_.2 RB55.1
N$8: CT2.P$4
N$9: LED_PWR.A R10.1
N$10: CT5.P$4
N$11: PCB2.P$64(GPIO8) SJ14.1
N$12: CT5.P$3
N$13: CT3.P$4
N$14: C16.1 SV2.6
N$15: C16.2 U1.3(EN)
N$17: BOOT_ESP.2 U1.25(IO0)
N$18: PCB2.P$57(3V3) R28.2
N$20: CT6.P$4
N$21: CT9.P$4
N$22: CT8.P$4
N$23: CT7.P$4
N$24: CT6.P$3
N$25 [power]: FB10.1 MCP1825.3(+3V3)
N$26: CT1.P$1 RB1.2 RB1_.2 RB19.1
N$27: CT2.P$1 RB2.2 RB2_.2 RB20.1
N$28 [gnd]: JP2.13
N$29: C11.1 C37.1 C57.1 C61.1 FB6.1 REF19X.2(VIN) REF19X.3(!SHDN) TP11.1
N$30: Q1.3(C) Q2.1(B) R16.2
N$31: Q1.1(B) Q3.3(C) R9.1 R14.2
N$32: Q2.3(C) R11.1 R15.2 R19.1
N$33: Q3.1(B) R18.1
N$34 [power]: FB11.1 MCP1825(ANALOG).3(+3V3)
N$35 [cts_vts]: CT4.P$1 RB4.2 RB4_.2 RB44.1
N$36: CT3.P$1 RB3.2 RB3_.2 RB21.1
N$37 [ant]: R6.1 SMA.1
N$38: CT4.P$3
N$40 [cts_vts]: CT6.P$1 RB6.2 RB6_.2 RB66.1
N$41: LED1.A R3.1
N$43: CT9.P$1 RB9.2 RB9_.2 RB24.1
N$44: C7.1 IC_VBAT.2(OUT) R8.1
N$45: CT8.P$1 RB8.2 RB8_.2 RB23.1
N$46: CT7.P$1 RB7.2 RB7_.2 RB22.1
NRST_STM: C9.1 KSS331GLFS.2 R33.2 RST_STM.1 SJ25.2 SJ32.1 SV3.3 USART1.6
NRST_STM_: C9.2 STM32F303VET6.14(NRST)
NRST_STM_ESP: SJ25.1 U1.30(IO18)
NRST_STM_RPI: PCB2.P$51(GPIO17) SJ32.2
OPAMP_INVERT-: SJ1.1 STM32F303VET6.55(PD8)
OPAMP_OUT [cts_vts]: SJ1.2
PC14: C31.1 LSE.P$1 STM32F303VET6.8(PC14/OSC32_IN)
PC15: C32.1 LSE.P$4 STM32F303VET6.9(PC15/OSC32_OUT)
PULSE1_RJ45: C41.1 JP4.1 RJ1.6
PULSE_2_RJ45: C46.1 C49.1 RJ2.6 STM32F303VET6.73(PF6)
RGND: C2.2 C14.2 C44.2 C48.2 FB7.2 RFM69HCW.7(GND) RFM69HCW.10(GND) SMA.2 SMA.3 SMA.4 SMA.5 U2.2P(GND) U2.16P(GND)
RPI_GPIO16: R12.2 STM32F303VET6.85(PD4)
RPI_GPIO16_RPI: PCB2.P$76(GPIO16) R12.1
RPI_GPIO20: R24.2 STM32F303VET6.86(PD5)
RPI_GPIO20_RPI: PCB2.P$78(GPIO20) R24.1
RPI_MISO: PCB2.P$61(GPIO9) SJ6.2
RPI_MOSI: PCB2.P$59(GPIO10) SJ5.2
RPI_PWR: R28.1 STM32F303VET6.62(PD15)
RPI_SPI_CLK: PCB2.P$63(GPIO11) SJ7.2
RST_RFM: RFM69HCW.6(!RES) STM32F303VET6.97(PE0) U2.14P(RESET)
RXD0_ESP: SJ21.2 SV2.4 U1.34(RXD0)
SCL: D34.A D35.K(C) JP2.10 OLED.2 R20.1 SJ27.2 STM32F303VET6.67(PA8) TB1.P$5 U1.36(IO22)
SCL_: PCB2.P$45(GPIO3) SJ27.1
SD_CARD_STM: JP1.2 STM32F303VET6.88(PD7)
SD_CS: JP1.1 MICROSD.PIN2(CD/DAT3) U1.7(IO35)
SDA: D21.A D33.K(C) JP2.8 OLED.1 R13.1 SJ26.1 STM32F303VET6.66(PC9) TB1.P$4 U1.33(IO21)
SDA_: PCB2.P$43(GPIO2) SJ26.2
SINGLEPHASE [cts_vts]: CV4.1 R29.2 STM32F303VET6.23(PA0) TP20.1
SPI1_CLK_SLAVE: SJ7.1 SJ10.2 STM32F303VET6.89(PB3)
SPI1_MISO_SLAVE: SJ4.2 SJ6.1 STM32F303VET6.90(PB4)
SPI1_MOSI_SLAVE: SJ5.1 SJ9.2 STM32F303VET6.91(PB5)
SPI1_NSS_SLAVE: SJ13.2 SJ14.2 STM32F303VET6.77(PA15)
SPI4_CLK_MASTER: RFM69HCW.13(SCK) STM32F303VET6.1(PE2) U2.12P(SCK)
SPI4_CS_RFM69_MASTER: RFM69HCW.14(!SEL) STM32F303VET6.2(PE3) U2.13P(NSS)
SPI4_MISO_MASTER: RFM69HCW.1(SDO) STM32F303VET6.4(PE5) U2.10P(MISO)
SPI4_MOSI_MASTER: RFM69HCW.12(SDI) STM32F303VET6.5(PE6) U2.11P(MOSI)
STM32_OPAMP_NON-INVERT+: STM32F303VET6.58(PD11)
STM32_OPAMP_OUT [cts_vts]: STM32F303VET6.51(PB12) TP2.1
SWCLK: STM32F303VET6.76(PA14) SV3.1
SWDIO: JP4.2 STM32F303VET6.72(PA13) SV3.2
THREEPHASE1: CV1.1 R25.2 STM32F303VET6.30(PA5)
THREEPHASE2: CV2.1 R26.2 STM32F303VET6.31(PA6)
THREEPHASE3: CV3.1 R27.2 STM32F303VET6.32(PA7)
TXD0_ESP: SJ20.2 SV2.5 U1.35(TXD0)
UART1_RX: PCB2.P$48(GPIO14) STM32F303VET6.69(PA10) USART1.4
UART1_TX: PCB2.P$50(GPIO15) STM32F303VET6.68(PA9) USART1.5
UART5_RX: SJ20.1 STM32F303VET6.83(PD2)
UART5_TX: SJ21.1 STM32F303VET6.80(PC12)
USART3_RX: R19.2 STM32F303VET6.95(PB8)
USART3_TX: R18.2 STM32F303VET6.96(PB9)
USB_DM: R32.2 STM32F303VET6.70(PA11)
USB_DM_: R32.1 USB-C.A7(D1-)
USB_DP: R30.1 R31.2 STM32F303VET6.71(PA12)
USB_DP_: R31.1 USB-C.A6(D1+)
USB_RST: R30.2 STM32F303VET6.84(PD3)
VBAT: C54.1 C55.1 G1.+ R8.2 STM32F303VET6.6(VBAT) TP12.P$1
VDD [power]: C2.1 C14.1 C44.1 FB5.1 RFM69HCW.9(VDD) U2.5P(VDD)
VREF+: C23.1 C38.1 R22.2 R55.2 REF19X.6(VOUT) STM32F303VET6.21(VREF+) TP8.1
Unconnected: CT1.P$3 CT2.P$3 CT3.P$3 CT7.P$3 CT8.P$3 CT9.P$3 JP2.1 JP2.3 JP2.4 JP2.6 JP2.9 JP2.11 MICROSD.PIN1(DAT2) MICROSD.PIN8(DAT1) PCB2.P$41(3V3) PCB2.P$52(GPIO18) PCB2.P$55(GPIO22) PCB2.P$56(GPIO23) PCB2.P$58(GPIO24) PCB2.P$62(GPIO25) PCB2.P$66(GPIO7) PCB2.P$67(ID_SD*) PCB2.P$68(ID_SC*) PCB2.P$69(GPIO5) PCB2.P$71(GPIO6) PCB2.P$72(GPIO12) PCB2.P$73(GPIO13) PCB2.P$75(GPIO19) PCB2.P$77(GPIO26) PCB2.P$80(GPIO21) REF19X.1(DNC_1) REF19X.5(DNC_2) REF19X.7(DNC_3) REF19X.8(DNC_4) RFM69HCW.3(FSK/DATA/NFFS) RFM69HCW.4(DCLK/CFIL/FFIT) RFM69HCW.5(CLK) RFM69HCW.11(!INT) STM32F303VET6.7(PC13) STM32F303VET6.10(PF9) STM32F303VET6.11(PF10) STM32F303VET6.15(PC0) STM32F303VET6.16(PC1) STM32F303VET6.17(PC2) STM32F303VET6.18(PC3) STM32F303VET6.19(PF2) STM32F303VET6.24(PA1) STM32F303VET6.25(PA2) STM32F303VET6.26(PA3) STM32F303VET6.29(PA4) STM32F303VET6.33(PC4) STM32F303VET6.34(PC5) STM32F303VET6.37(PB2) STM32F303VET6.45(PE14) STM32F303VET6.46(PE15) STM32F303VET6.47(PB10) STM32F303VET6.48(PB11) STM32F303VET6.52(PB13) STM32F303VET6.56(PD9) STM32F303VET6.57(PD10) STM32F303VET6.79(PC11) STM32F303VET6.92(PB6) STM32F303VET6.93(PB7) SV2.2 U1.4(SENSOR_VP) U1.5(SENSOR_VN) U1.6(IO34) U1.8(IO32) U1.9(IO33) U1.10(IO25) U1.11(IO26) U1.12(IO27) U1.17(SHD/SD2) U1.18(SWP/SD3) U1.19(SCS/CMD) U1.20(SCL/CLK) U1.21(SDO/SD0) U1.22(SDI/SD1) U1.24(IO2) U1.26(IO4) U1.27(IO16) U1.28(IO17) U1.29(IO5) U1.37(IO23) U2.3P(DIO3) U2.4P(DIO4) U2.8P(DIO2) U2.15P(DIO5) USART1.2

## Notes on the sheet
- VTs and CTs
- 3-phase 2mA input
- Single Phase AC-AC 9V measurement
- 3ph bias ESD diodes
- USB Input
- STM32F3 OpenEnergyMonitor Concept
- Open Source Hardware: GNU General Public Licence v3
- Reference
- Power Supply
- maybe DNGA comes off the ANA supply with FB in series
- VDDA TESTING
- supperfluous?
- STAR GND
- STM32 Hardware Guide suggests 4.7uF on VDD and 1uF on VDDA
- 2.2uF was also 
  okay in 
  previous testing.
- VDD/VSS Decoupling Capacitors
- STM32
- I2C
  protection
- I2C
  pullups
- MBUS
- rPi
- BATTERY/RTC
- PUSH_BUTTON
- LEDs
- BIAS
- Expansion
- OLED
- GPIO | Connectors
- I2C etc.
- ESP32
- mbus etc.
- RFMxx
- SD card normally conn'd to ESP32
- MBUS

## Library data of the parts
BOOT BOOT_ESP RST_STM = SparkFun:M02: Header 2 Standard 2-pin 0.1" header. Use with straight break away headers (SKU : PRT-00116), right angle break away headers (PRT-00553), swiss pins (PRT-00743), machine pins (PRT-00117), and female headers (PRT-00115). Molex polarized connector foot print use with SKU : PRT-08233 with associated crimp pins and housings.
C1-C8 C16 C17 C19 C22 C26 C28 C34-C38 C40-C42 C45-C48 C50 C52 C53 C56 C58 C61 = resistor:C-EU: CAPACITOR, European symbol
C9-C15 C18 C20 C21 C23-C25 C27 C29-C33 C39 C43 C44 C49 C51 C54 C55 C57 C59 C60 CF1-CF9 CV1-CV4 = rcl:C-EU: CAPACITOR, European symbol; SPICEPREFIX: C
CT1-CT9 = SJ-3523-SMT:SJ-3523-SMT: 3.5mm Stereo Jack SMT; MPN: SJ-3523-SMT
D1 D4 = adafruit:DIODE: Diode; MPN: PESD3V3S1UB
D2 D3 D5-D11 D14 D17 D18 D21 D26 D33-D35 = adafruit:DIODE: Diode
D40 = microbuilder:DIODE: Diode
FB1 FB2 = microbuilder:FERRITE: Ferrite Bead 0603 MMZ1608B121C - 120 Ohm @ 100MHz, 600mA, 0.15 Ohm DC Resistance - Digikey: 445-2164-1-ND BK1608HW121-T - 120 Ohm, 600mA Ferrite Chip - Digikey: 587-1876-2-ND 0805 HZ0805B272R-10 - 2.7K Ohm @ 100MHz, 200mA, 0.8 Ohm DC Resistance - Digikey: 240-2504-1-ND (see also Murata BLM21BD272SN1L) MMZ2012Y152B - 1.5K Ohm @ 100MHz, 500mA, 0.4 Ohm DC Resistance - Digikey: 445-1560-1-ND - Mainly for high frequency (80-400MHz) MMZ2012R102A - 1K Ohm @ 100MHz, 500mA, 0.3 Ohm DC Resistance - Digikey: 445-1555-2-ND - More general purpose (10-200MHz); MPN: MH1608-601Y
FB3 FB4 FB7 = microbuilder:FERRITE: Ferrite Bead 0603 MMZ1608B121C - 120 Ohm @ 100MHz, 600mA, 0.15 Ohm DC Resistance - Digikey: 445-2164-1-ND BK1608HW121-T - 120 Ohm, 600mA Ferrite Chip - Digikey: 587-1876-2-ND 0805 HZ0805B272R-10 - 2.7K Ohm @ 100MHz, 200mA, 0.8 Ohm DC Resistance - Digikey: 240-2504-1-ND (see also Murata BLM21BD272SN1L) MMZ2012Y152B - 1.5K Ohm @ 100MHz, 500mA, 0.4 Ohm DC Resistance - Digikey: 445-1560-1-ND - Mainly for high frequency (80-400MHz) MMZ2012R102A - 1K Ohm @ 100MHz, 500mA, 0.3 Ohm DC Resistance - Digikey: 445-1555-2-ND - More general purpose (10-200MHz)
FB5 FB6 FB8-FB11 = microbuilder:FERRITE: Ferrite Bead 0603 MMZ1608B121C - 120 Ohm @ 100MHz, 600mA, 0.15 Ohm DC Resistance - Digikey: 445-2164-1-ND BK1608HW121-T - 120 Ohm, 600mA Ferrite Chip - Digikey: 587-1876-2-ND 0805 HZ0805B272R-10 - 2.7K Ohm @ 100MHz, 200mA, 0.8 Ohm DC Resistance - Digikey: 240-2504-1-ND (see also Murata BLM21BD272SN1L) MMZ2012Y152B - 1.5K Ohm @ 100MHz, 500mA, 0.4 Ohm DC Resistance - Digikey: 445-1560-1-ND - Mainly for high frequency (80-400MHz) MMZ2012R102A - 1K Ohm @ 100MHz, 500mA, 0.3 Ohm DC Resistance - Digikey: 445-1555-2-ND - More general purpose (10-200MHz); MPN: BLM18BD252SN1D
G1 = CH291-1220LF:CH291-1220LF: Battery Holder, SMT, 12mm multicomp PART NO. CH291-1220LF Source: Data sheet <http://www.farnell.com/datasheets/1505860.pdf>; AVAILABILITY: Unavailable; DESCRIPTION: BATTERY HOLDER, SMT, 12MM; Accessory Type: Coin Cell Battery Holder; For Use With: 1220 Coin Cell Batteries; Battery ...; MF: Multicomp; MP: CH291-1220LF; PACKAGE: None; PRICE: None
HSE = 6mm 3m5mm crystal multicomp pro abracon:6MM_3.5MM_CRYSTAL: Abracon 12MHz Crystal Unit +/-20ppm SMD 4-Pin 6 x 3.6 x 1.2mm Source: Datasheet <http://uk.rs-online.com/web/p/products/1712778P>; DESCRIPTION: Abracon 12MHz Crystal Unit +/-20ppm SMD 4-Pin 6 x 3.6 x 1.2mm; HEIGHT: mm; MANUFACTURER_NAME: ABRACON; MANUFACTURER_PART_NUMBER: ABMM2-12.000MHZ-E2-T; MPN: X50328MSD4SC; MPN2: MCSJK-6G-8.00-16-10-80-B-20; RS_PART_NUMBER: 1712778P; RS_PRICE-STOCK: http://uk.rs-online.com/web/p/products/1712778P
IC_VBAT = AP7313-33SRG-7:AP7313-33SRG-7: Diodes Inc AP7313-33SRG-7, Single Linear Voltage Regulator, 150mA 3.3 V, +/-2%, 3-Pin SOT-23R Source: Datasheet <http://uk.rs-online.com/web/p/products/7513067P>; ALLIED_NUMBER: 70437459; DESCRIPTION: Diodes Inc AP7313-33SRG-7, Single Linear Voltage Regulator, 150mA 3.3 V, +/-2%, 3-Pin SOT-23R; HEIGHT: 1.35mm; MANUFACTURER_NAME: Diodes Inc.; MANUFACTURER_PART_NUMBER: AP7313-33SRG-7; MPN: AP7313-33SRG-7; RS_PART_NUMBER: 7513067P; RS_PRICE-STOCK: http://uk.rs-online.com/web/p/products/7513067P
J1 JP4 SJ1 SJ3 SJ5-SJ7 SJ14 SJ26 SJ27 SJ32 = SparkFun-Jumpers:JUMPER-SMT_2_NC_TRACE: Normally closed trace jumper This jumper has a trace between two pads so it's normally closed (NC). Use a razor knife to open the connection. For best results follow the IPC guidelines for cutting traces: Cutout at least 0.063 mm (0.005 in). Remove all loose material to clean up the cut area. Seal the cut with an approved epoxy. Reapply solder to reclose the connection.
JP1 SJ4 SJ9 SJ10 SJ13 = SparkFun-Jumpers:JUMPER-SMT_2_NO: Normally open jumper This jumper has two pads in close proximity to each other. Apply solder to close the connection. Round pads are easier to solder for beginners, but are a lot larger. SparkFun Product that uses the round pads: SparkFun EL Sequencer <https://www.sparkfun.com/products/12781>
JP2 = Connector:PINHD-2X7: PIN HEADER; CATEGORY: CONNECTOR; SUB-CATEGORY: PIN-HEADER
JP6 = SparkFun-Jumpers:JUMPER-SMT_2_NC_PASTE: Normally closed solder jumper This jumper has an aperture in the stencil to allow solder paste to bridge the split in the wire so it's normally closed (NC). Wick off the solder to open the connection. Reapply solder to reclose the connection.
KSS331GLFS = KSS221GLFS:KSS221GLFS: IP40 Side Tactile Switch, SPST-NO 50 mA Source: Datasheet <http://uk.rs-online.com/web/p/products/7931689P>; DESCRIPTION: IP40 Side Tactile Switch, SPST-NO 50 mA; HEIGHT: mm; MANUFACTURER_NAME: C & K COMPONENTS; MANUFACTURER_PART_NUMBER: KSS221GLFS; MPN: KSS331GLFS; RS_PART_NUMBER: 7931689P; RS_PRICE-STOCK: http://uk.rs-online.com/web/p/products/7931689P
LED1 LED_PWR = adafruit:LED: LED OSRAM: - CHIPLED LG R971, LG N971, LY N971, LG Q971, LY Q971, LO R971, LY R971 LH N974, LH R974 LS Q976, LO Q976, LY Q976 LO Q996 - Hyper CHIPLED LW Q18S LB Q993, LB Q99A, LB R99A - SideLED LS A670, LO A670, LY A670, LG A670, LP A670 LB A673, LV A673, LT A673, LW A673 LH A674 LY A675 LS A676, LA A676, LO A676, LY A676, LW A676 LS A679, LY A679, LG A679 - Hyper Micro SIDELED® LS Y876, LA Y876, LO Y876, LY Y876 LT Y87S - SmartLED LW L88C, LW L88S LB L89C, LB L89S, LG L890 LS L89K, LO L89K, LY L89K LS L896, LA L896, LO L896, LY L896 - TOPLED LS T670, LO T670, LY T670, LG T670, LP T670 LSG T670, LSP T670, LSY T670, LOP T670, LYG T670 LG T671, LOG T671, LSG T671 LB T673, LV T673, LT T673, LW T673 LH T674 LS T676, LA T676, LO T676, LY T676, LB T676, LH T676, LSB T676, LW T676 LB T67C, LV T67C, LT T67C, LS T67K, LO T67K, LY T67K, LW E67C LS E67B, LA E67B, LO E67B, LY E67B, LB E67C, LV E67C, LT E67C LW T67C LS T679, LY T679, LG T679 LS T770, LO T770, LY T770, LG T770, LP T770 LB T773, LV T773, LT T773, LW T773 LH T774 LS E675, LA E675, LY E675, LS T675 LS T776, LA T776, LO T776, LY T776, LB T776 LHGB T686 LT T68C, LB T68C - Hyper Mini TOPLED® LB M676 - Mini TOPLED Santana® LG M470 LS M47K, LO M47K, LY M47K Source: http://www.osram.convergy.de/; MPN: C2297
LED2 = adafruit:LED: LED OSRAM: - CHIPLED LG R971, LG N971, LY N971, LG Q971, LY Q971, LO R971, LY R971 LH N974, LH R974 LS Q976, LO Q976, LY Q976 LO Q996 - Hyper CHIPLED LW Q18S LB Q993, LB Q99A, LB R99A - SideLED LS A670, LO A670, LY A670, LG A670, LP A670 LB A673, LV A673, LT A673, LW A673 LH A674 LY A675 LS A676, LA A676, LO A676, LY A676, LW A676 LS A679, LY A679, LG A679 - Hyper Micro SIDELED® LS Y876, LA Y876, LO Y876, LY Y876 LT Y87S - SmartLED LW L88C, LW L88S LB L89C, LB L89S, LG L890 LS L89K, LO L89K, LY L89K LS L896, LA L896, LO L896, LY L896 - TOPLED LS T670, LO T670, LY T670, LG T670, LP T670 LSG T670, LSP T670, LSY T670, LOP T670, LYG T670 LG T671, LOG T671, LSG T671 LB T673, LV T673, LT T673, LW T673 LH T674 LS T676, LA T676, LO T676, LY T676, LB T676, LH T676, LSB T676, LW T676 LB T67C, LV T67C, LT T67C, LS T67K, LO T67K, LY T67K, LW E67C LS E67B, LA E67B, LO E67B, LY E67B, LB E67C, LV E67C, LT E67C LW T67C LS T679, LY T679, LG T679 LS T770, LO T770, LY T770, LG T770, LP T770 LB T773, LV T773, LT T773, LW T773 LH T774 LS E675, LA E675, LY E675, LS T675 LS T776, LA T776, LO T776, LY T776, LB T776 LHGB T686 LT T68C, LB T68C - Hyper Mini TOPLED® LB M676 - Mini TOPLED Santana® LG M470 LS M47K, LO M47K, LY M47K Source: http://www.osram.convergy.de/; MPN: C2296
LED3 = adafruit:LED: LED OSRAM: - CHIPLED LG R971, LG N971, LY N971, LG Q971, LY Q971, LO R971, LY R971 LH N974, LH R974 LS Q976, LO Q976, LY Q976 LO Q996 - Hyper CHIPLED LW Q18S LB Q993, LB Q99A, LB R99A - SideLED LS A670, LO A670, LY A670, LG A670, LP A670 LB A673, LV A673, LT A673, LW A673 LH A674 LY A675 LS A676, LA A676, LO A676, LY A676, LW A676 LS A679, LY A679, LG A679 - Hyper Micro SIDELED® LS Y876, LA Y876, LO Y876, LY Y876 LT Y87S - SmartLED LW L88C, LW L88S LB L89C, LB L89S, LG L890 LS L89K, LO L89K, LY L89K LS L896, LA L896, LO L896, LY L896 - TOPLED LS T670, LO T670, LY T670, LG T670, LP T670 LSG T670, LSP T670, LSY T670, LOP T670, LYG T670 LG T671, LOG T671, LSG T671 LB T673, LV T673, LT T673, LW T673 LH T674 LS T676, LA T676, LO T676, LY T676, LB T676, LH T676, LSB T676, LW T676 LB T67C, LV T67C, LT T67C, LS T67K, LO T67K, LY T67K, LW E67C LS E67B, LA E67B, LO E67B, LY E67B, LB E67C, LV E67C, LT E67C LW T67C LS T679, LY T679, LG T679 LS T770, LO T770, LY T770, LG T770, LP T770 LB T773, LV T773, LT T773, LW T773 LH T774 LS E675, LA E675, LY E675, LS T675 LS T776, LA T776, LO T776, LY T776, LB T776 LHGB T686 LT T68C, LB T68C - Hyper Mini TOPLED® LB M676 - Mini TOPLED Santana® LG M470 LS M47K, LO M47K, LY M47K Source: http://www.osram.convergy.de/; MPN: C2293
LMV1-LMV3 LMV824 = LMV824IDG4:LMV824IDG4: LMV824IDG4, Quad Operational Amplifier 5.5MHz R-R, 3V, 14-Pin SOIC Source: Datasheet <http://uk.rs-online.com/web/p/products/6610574>; DESCRIPTION: LMV824IDG4, Quad Operational Amplifier 5.5MHz R-R, 3V, 14-Pin SOIC; HEIGHT: 1.75mm; MANUFACTURER_NAME: Texas Instruments; MANUFACTURER_PART_NUMBER: LMV824IDG4; RS_PART_NUMBER: 6610574; RS_PRICE-STOCK: http://uk.rs-online.com/web/p/products/6610574
LSE = microbuilder:CRYSTAL: Crystals HC49UP - Surface Mount Crystal 4.0MHz 18pF +/-30ppm Surface Mount Crystal [Digikey: 535-9857-1-ND] 12.0 MHz Surface Mount Crystal [Digikey: 535-9869-6-ND] 25.0 MHz Surface Mount Crystal [Digikey: 535-9078-1-ND] 2.5 x 2.0mm - MEMs SMT Crystal 16.0 MHz 10pF 20ppm 2.5 x 2.0mm Crystal [Digikey -40-85°C: 535-10923-1-ND] 3.2 x 2.5mm - MEMs SMT Crystal 12.0 MHz 8pF 15ppm 3.2 x 2.5mm Crystal [Digikey: -10-70°C: 644-1047-1-ND -40-125°C: 644-1128-1-ND] 16.0 MHz 8pF 15ppm 3.2 x 2.5mm Crystal [Digikey: -10-70°C: 644-1049-1-ND -40-125°C: 644-1129-2-ND] 16.0 MHz 10pF 10ppm 3.2 x 2.5mm Crystal [Digikey: 644-1100-1-ND] 27.12 MHz 18pF 30ppm 3.2 x 2.5mm Crystal [Digikey: 887-1424-1-ND] 27.12MHz 10pF 10ppm 3.2 x 2.5mm Crystal [Digikey: 887-1329-1-ND] 4.9 x 1.8mm - MEMs SMT Crystal 32.768 KHz 12.5pF 20ppm 4.9 x 1.8mm Crystal [Digikey: SE2415CT-ND] 8.0 x 3.8mm - Surface Mount Crystal 32.768kHz 12.5pF 20ppm -40°C-85°C [Digikey: 535-9166-2-ND] Cylinder 32.768KHz Cylinder Crystal (2x6mm body) [Ex. Digikey: 300-8341-2-ND]; MPN: ABS25-32.768KHZ-T
MCP1825 MCP1825(ANALOG) = SteelCaveRobotics-Power:MCP1825: MCP1825 3.3v LDO Linear Regulator
MICROSD = MOLEX 47219-2001:47219-2001_MICROSD
OLED = con-lstb-db:MA04-1-OLED: PIN HEADER with OLED footprint.
PCB2 = e14_Rpi3_RevA+mirror-pcb copy:RPI3: Device for Raspberry Pi 3 board created by Dave Young for www.element14.com More information and support community is available at https://www.element14.com/community/community/raspberry-pi Device for Raspberry Pi 3 board updated by Gerald Schwarz for www.element14.com On RPI3 addet the layer milling and created a mirrored shield.; MPN: M20-7872042
Q1 = microbuilder:TRANSISTOR_PNP: PNP Transistor Transistor (PNP) 800mA 60V, 1.6V VCE @ 500mA [Digikey: MMBT2907AFSTR-ND] Transistor (PNP) Low Sat - 1.5A 20V, 260mV VCE @ 400mA [Digikey: ZXTP25020DFLTR-ND] SOT23-R - SOT23 footprint optimised for use with solder paste and reflow ovens. SOT23-W - SOT23 footprint optimised for hand-soldering (larger pads).; MPN: SMMBT3906LT1G
Q2 Q3 = microbuilder:TRANSISTOR_NPN: NPN Transistor Transistor (NPN) 500mA 45V - BC817 [Digikey: 568-1631-1-ND] Transistor (NPN) 500mA 45V - BC817,215 [Mouser: 771-BC817-T/R] SOT23-R - SOT23 footprint optimised for use with solder paste and reflow ovens. SOT23-W - SOT23 footprint optimised for hand-soldering (larger pads).; MPN: KST3904MTF
R1 R2 R7 R8 R13 R20 R21 R25-R27 R29 R43 R53 R55 R56 RF1-RF9 = resistor:R-EU_: RESISTOR, European symbol
R3-R6 R9-R12 R14-R19 R22 R24 R28 R30-R34 R39-R41 R60-R68 RB1 RB1_ RB2 RB2_ RB3 RB3_ RB4 RB4_ RB5 RB5_ RB6 RB6_ RB7 RB7_ RB8 RB8_ RB9 RB9_ RB19-RB24 RB44 RB55 RB66 = rcl:R-EU_: RESISTOR, European symbol; SPICEPREFIX: R
REF19X = LT1461AIS8:LT1461AIS8-3.3#PBF: Linear Technology LT1461AIS8-3.3#PBF, Series Voltage Reference 3.3V, 0.04% 20 V max., 8-Pin SOIC Source: Datasheet <http://uk.rs-online.com/web/p/products/7618279P>; DESCRIPTION: Linear Technology LT1461AIS8-3.3#PBF, Series Voltage Reference 3.3V, 0.04% 20 V max., 8-Pin SOIC; HEIGHT: 1.752mm; MANUFACTURER_NAME: Linear Technology; MANUFACTURER_PART_NUMBER: LT1461AIS8-3.3#PBF; MPN: REF191GSZ; RS_PART_NUMBER: 7618279P; RS_PRICE-STOCK: http://uk.rs-online.com/web/p/products/7618279P
RFM69HCW = rfm12b _ rfm69cw:RFM12_SMD: RFM12 is a low costing ISM band transceiver module implemented with unique PLL. It works signal ranges from 315/433/868/915MHZ bands, comply with FCC, ETSI regulation. The SPI interface is used to communicate with microcontroller for parameter setting.
RJ1 RJ2 = 95501-6889 rj45 smt:95501-6889: Molex Cat3 8-Way Female RJ45 Connector Right Angle Surface Mount Unshielded Source: Datasheet <https://www.molex.com/pdm_docs/sd/955016889_sd.pdf>; ALLIED_NUMBER: 70372913; ALLIED_PRICE-STOCK: https://www.alliedelec.com/molex-incorporated-95501-6889/70372913/; DESCRIPTION: Molex Cat3 8-Way Female RJ45 Connector Right Angle Surface Mount Unshielded; HEIGHT: 11.5mm; MANUFACTURER_NAME: Molex; MANUFACTURER_PART_NUMBER: 95501-6889; MOUSER_PART_NUMBER: 538-95501-6889; MOUSER_PRICE-STOCK: https://www.mouser.com/Search/Refine.aspx?Keyword=538-95501-6889; RS_PART_NUMBER: 3862738; RS_PRICE-STOCK: http://uk.rs-online.com/web/p/products/3862738
S1 = switch-omron:31-XX: OMRON SWITCH; MPN: CST06S08H; OC_FARNELL: 959704; OC_NEWARK: 36M3582
S3 = Switch:KSC222JLFS: SWITCH TACTILE SPST-NO 0.05A 32V Manufacturer's datasheet <https://dznh3ojzb2azq.cloudfront.net/products/Tactile/KSC2/documents/datasheet.pdf>; CREATED_BY: PCBLayout.com; DIGIKEY_PARTNO: CKN9195TR-ND; MANUFACTURER: C&K; MPN: KSC222J LFS; MPN2: C318887
SJ20 SJ21 SJ23 SJ25 = SparkFun:SOLDERJUMPER: Solder Jumper Standard SMD solder jumper. Used to automate production. Two varients : Normally Open and Normally Closed are the same, but have different paste layers. NC will have a large amount of paste and should jumper during reflow.
SMA = 5-1814400-1 sma connector:5-1814400-1: SMA Connector Jack, Female Socket 50 Ohm Through Hole, Right Angle Solder Source: Datasheet <http://uk.rs-online.com/web/p/products/6163400>; ALLIED_NUMBER: 70084631; DESCRIPTION: SMA Connector Jack, Female Socket 50 Ohm Through Hole, Right Angle Solder; HEIGHT: 10.43mm; MANUFACTURER_NAME: TE Connectivity; MANUFACTURER_PART_NUMBER: 5-1814400-1; RS_PART_NUMBER: 6163400; RS_PRICE-STOCK: http://uk.rs-online.com/web/p/products/6163400
STM32F303VET6 = stm32f303:STM32F303XB
SV2 USART1 = con-lstb-db:MA06-1: PIN HEADER; OC_FARNELL: unknown; OC_NEWARK: unknown
SV3 = con-lstb-db:MA03-1: PIN HEADER; OC_FARNELL: unknown; OC_NEWARK: unknown
TB1-TB3 = 3.5mm terminal block rs pro:3.5MM_TB_X6
TP1 TP2 TP7-TP12 TP18-TP20 = SparkFun-Connectors:TEST-POINT: SparkFun Test Points Bare copper test points for troubleshooting or In-Circuit-Testing. These are used by our Production team for verifying production board runs using pogo-pins on test beds. SparkFun Products: SparkFun LSM9DS1 Breakout <https://www.sparkfun.com/products/13284> SparkFun PSOC <https://www.sparkfun.com/products/13714> SparkFun Load Cell Amplifier <https://www.sparkfun.com/products/13879>
U1 = ESP32-WROOM-32D:ESP32-WROOM-32D: IC: SoC; GPIO, I2C, I2S, IR, SD, SDIO, SPI, UART; 2.7÷3.6VDC; 20dBm; AVAILABILITY: Unavailable; DESCRIPTION: IC: SoC; GPIO, I2C, I2S, IR, SD, SDIO, SPI, UART; 2.7÷3.6VDC; 20dBm; MF: Espressif Systems; MP: ESP32-WROOM-32D; PACKAGE: Module Espressif Systems; PRICE: None
U2 = microbuilder:RFM69HCW: RFM69HCW - ISM Band RF Transceiver
U$2 = BOOST MODULE CN6009:BOOST_MODULE
USB-C = CSP-USC16-TR:CSP-USC16-TR: CSP-USC16-TR TOBY.CO.UK; MPN: CSP-USC16-TR
VT1 = adafruit:2.1MMJACK: 2.1mm x 5.5mm THM DC jack with internal switch. Digikey part #PJ-102A, 4UCON part #05537 2.1mm x 5.5mm SMT DC jack with internal switch. Digikey part #PJ-002A-SMT, 4UCON part #03267 By microbuilder.eu & adafruit.com; MPN: FC68148S

## Net classes
0 default: width 0.178 mm, drill 0.5 mm, clearance 0.152 mm
1 power: width 0.254 mm, drill 0.5 mm, clearance 0.152 mm
2 gnd: width 0.254 mm, drill 0.5 mm, clearance 0.152 mm
3 ant: width 0.406 mm, drill 0.5 mm, clearance 0.254 mm
4 cts_vts: width 0.254 mm, drill 0.5 mm, clearance 0.229 mm